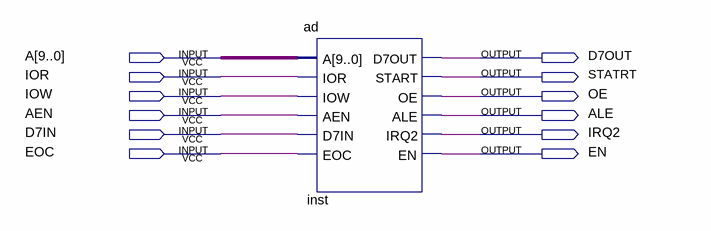
[diagram p0: schematic sheet]
// Quartus schematic AD_down.bdf as structural Verilog: 1 symbols, 12 pins
module AD_down (
  input  [9:0] A,
  input  IOR,
  input  IOW,
  input  AEN,
  input  D7IN,
  input  EOC,
  output D7OUT,
  output STATRT,
  output OE,
  output ALE,
  output IRQ2,
  output EN
);

  ad inst (
    .A(A), .IOR(IOR), .IOW(IOW), .AEN(AEN), .D7IN(D7IN), .EOC(EOC), .D7OUT(D7OUT), .START(STATRT), .OE(OE),
    .ALE(ALE), .IRQ2(IRQ2), .EN(EN));
endmodule
